# EAGLE schematic piezo-buffer-and-preamp_v0-1 (EAGLE 7.5.0)
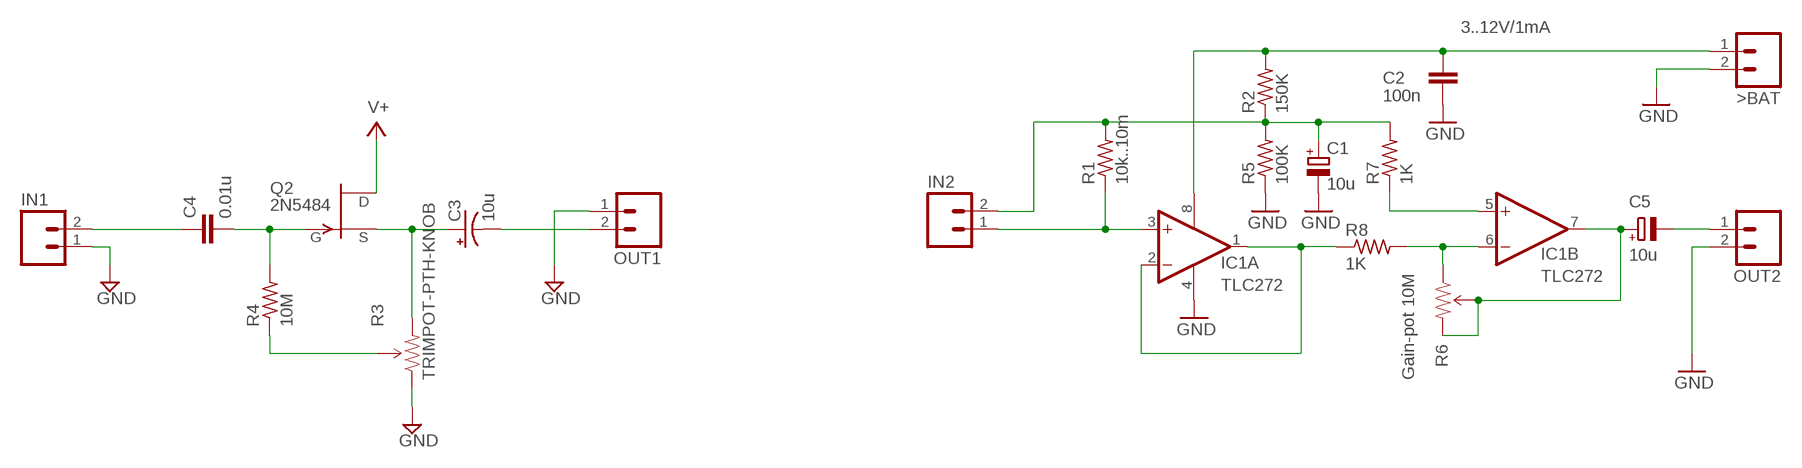
[diagram p0: schematic, sheet 1]

## Parts
>BAT  M02LOCK  [1X02_LOCK]
C1  10u  CPOL-EUE2.5-5  [E2,5-5]
C2  100n  C-EU025-025X050  [C025-025X050]
C3  10u  CAP_POLPTH2  [CPOL-RADIAL-10UF-25V]
C4  0.01u  C5/3  [C5B3]
C5  10u  CPOL-EUE2.5-5  [E2,5-5]
IC1  TLC272  TLC272P  [DIL08]
IN1  M02LOCK  [1X02_LOCK]
IN2  M02LOCK  [1X02_LOCK]
OUT1  M02LOCK  [1X02_LOCK]
OUT2  M02LOCK  [1X02_LOCK]
Q2  2N5484  [TO92-]
R1  10k..10m  R-US_0204/2V  [0204V]
R2  150K  R-US_0204/2V  [0204V]
R3  TRIMPOT-PTH-KNOB  [3386U]
R4  10M  R-US_0204/2V  [0204V]
R5  100K  R-US_0204/2V  [0204V]
R6  Gain-pot 10M  TRIMPOT-PTH-KNOB  [3386U]
R7  1K  R-US_0204/2V  [0204V]
R8  1K  R-US_0204/2V  [0204V]

## Nets
CH2: C3.2(-) OUT1.2
GND: >BAT.2 C1.- C2.1 IC1.4(P:V-) IN1.1 OUT1.1 OUT2.2 R3.1(CCW) R5.1
JFET-GATE1: C4.2 Q2.1(G) R4.2
JFET-SOURCE1: C3.1(+) Q2.2(S) R3.3(CW)
N$1: R3.2(WIPER) R4.1
N$2: IC1.6(B:-IN) R6.1(CCW) R8.2
N$3: C1.+ IN2.2 R1.2 R2.1 R5.2 R7.2
N$4: C4.1 IN1.2
N$5: IC1.5(B:+IN) R7.1
N$6: C5.+ IC1.7(B:OUT) R6.2(WIPER) R6.3(CW)
N$8: IC1.3(A:+IN) IN2.1 R1.1
N$14: IC1.1(A:OUT) IC1.2(A:-IN) R8.1
OUT1: C5.- OUT2.1
V9V: >BAT.1 C2.2 IC1.8(P:V+) R2.2
V+: Q2.3(D)

## Notes on the sheet
- 3..12V/1mA

## Library data of the parts
>BAT IN1 IN2 OUT1 OUT2 = SparkFun-Connectors:M02: Header 2 Standard 2-pin 0.1" header. Use with straight break away headers (SKU : PRT-00116), right angle break away headers (PRT-00553), swiss pins (PRT-00743), machine pins (PRT-00117), and female headers (PRT-00115). Molex polarized connector foot print use with SKU : PRT-08233 with associated crimp pins and housings.
C1 C5 = rcl:CPOL-EU: POLARIZED CAPACITOR, European symbol
C2 = rcl:C-EU: CAPACITOR, European symbol
C3 = SparkFun-Passives:CAP_POL: Capacitor Polarized These are standard SMD and PTH capacitors. Normally 10uF, 47uF, and 100uF in electrolytic and tantalum varieties. Always verify the external diameter of the through hole cap, it varies with capacity, voltage, and manufacturer. The EIA devices should be standard.
C4 = capacitor-wima:C: CAPACITOR naming: grid - package width
IC1 = linear:TLC272: OP AMP
Q2 = transistor-fet:?548*: N-Channel JFETs Source: VISHAY 2N5484.pdf Compatible: TO92 2N5245 J304 J305 U310 J308 J309 J310 TO72 2N4416 2N4416A 2N3823 2N4351 3N169 3N170 3N171 MFE3002 TO18 2N3796 2N3797 MFE825 Source: Motorola European Master Guide Pacge 3-59
R1 R2 R4 R5 R7 R8 = resistor:R-US_: RESISTOR, American symbol
R3 R6 = SparkFun-Electromechanical:TRIMPOT: Various small potentiometers for "set-and-forget" applications